# EAGLE schematic Thor_v1 (EAGLE 7.7.0)
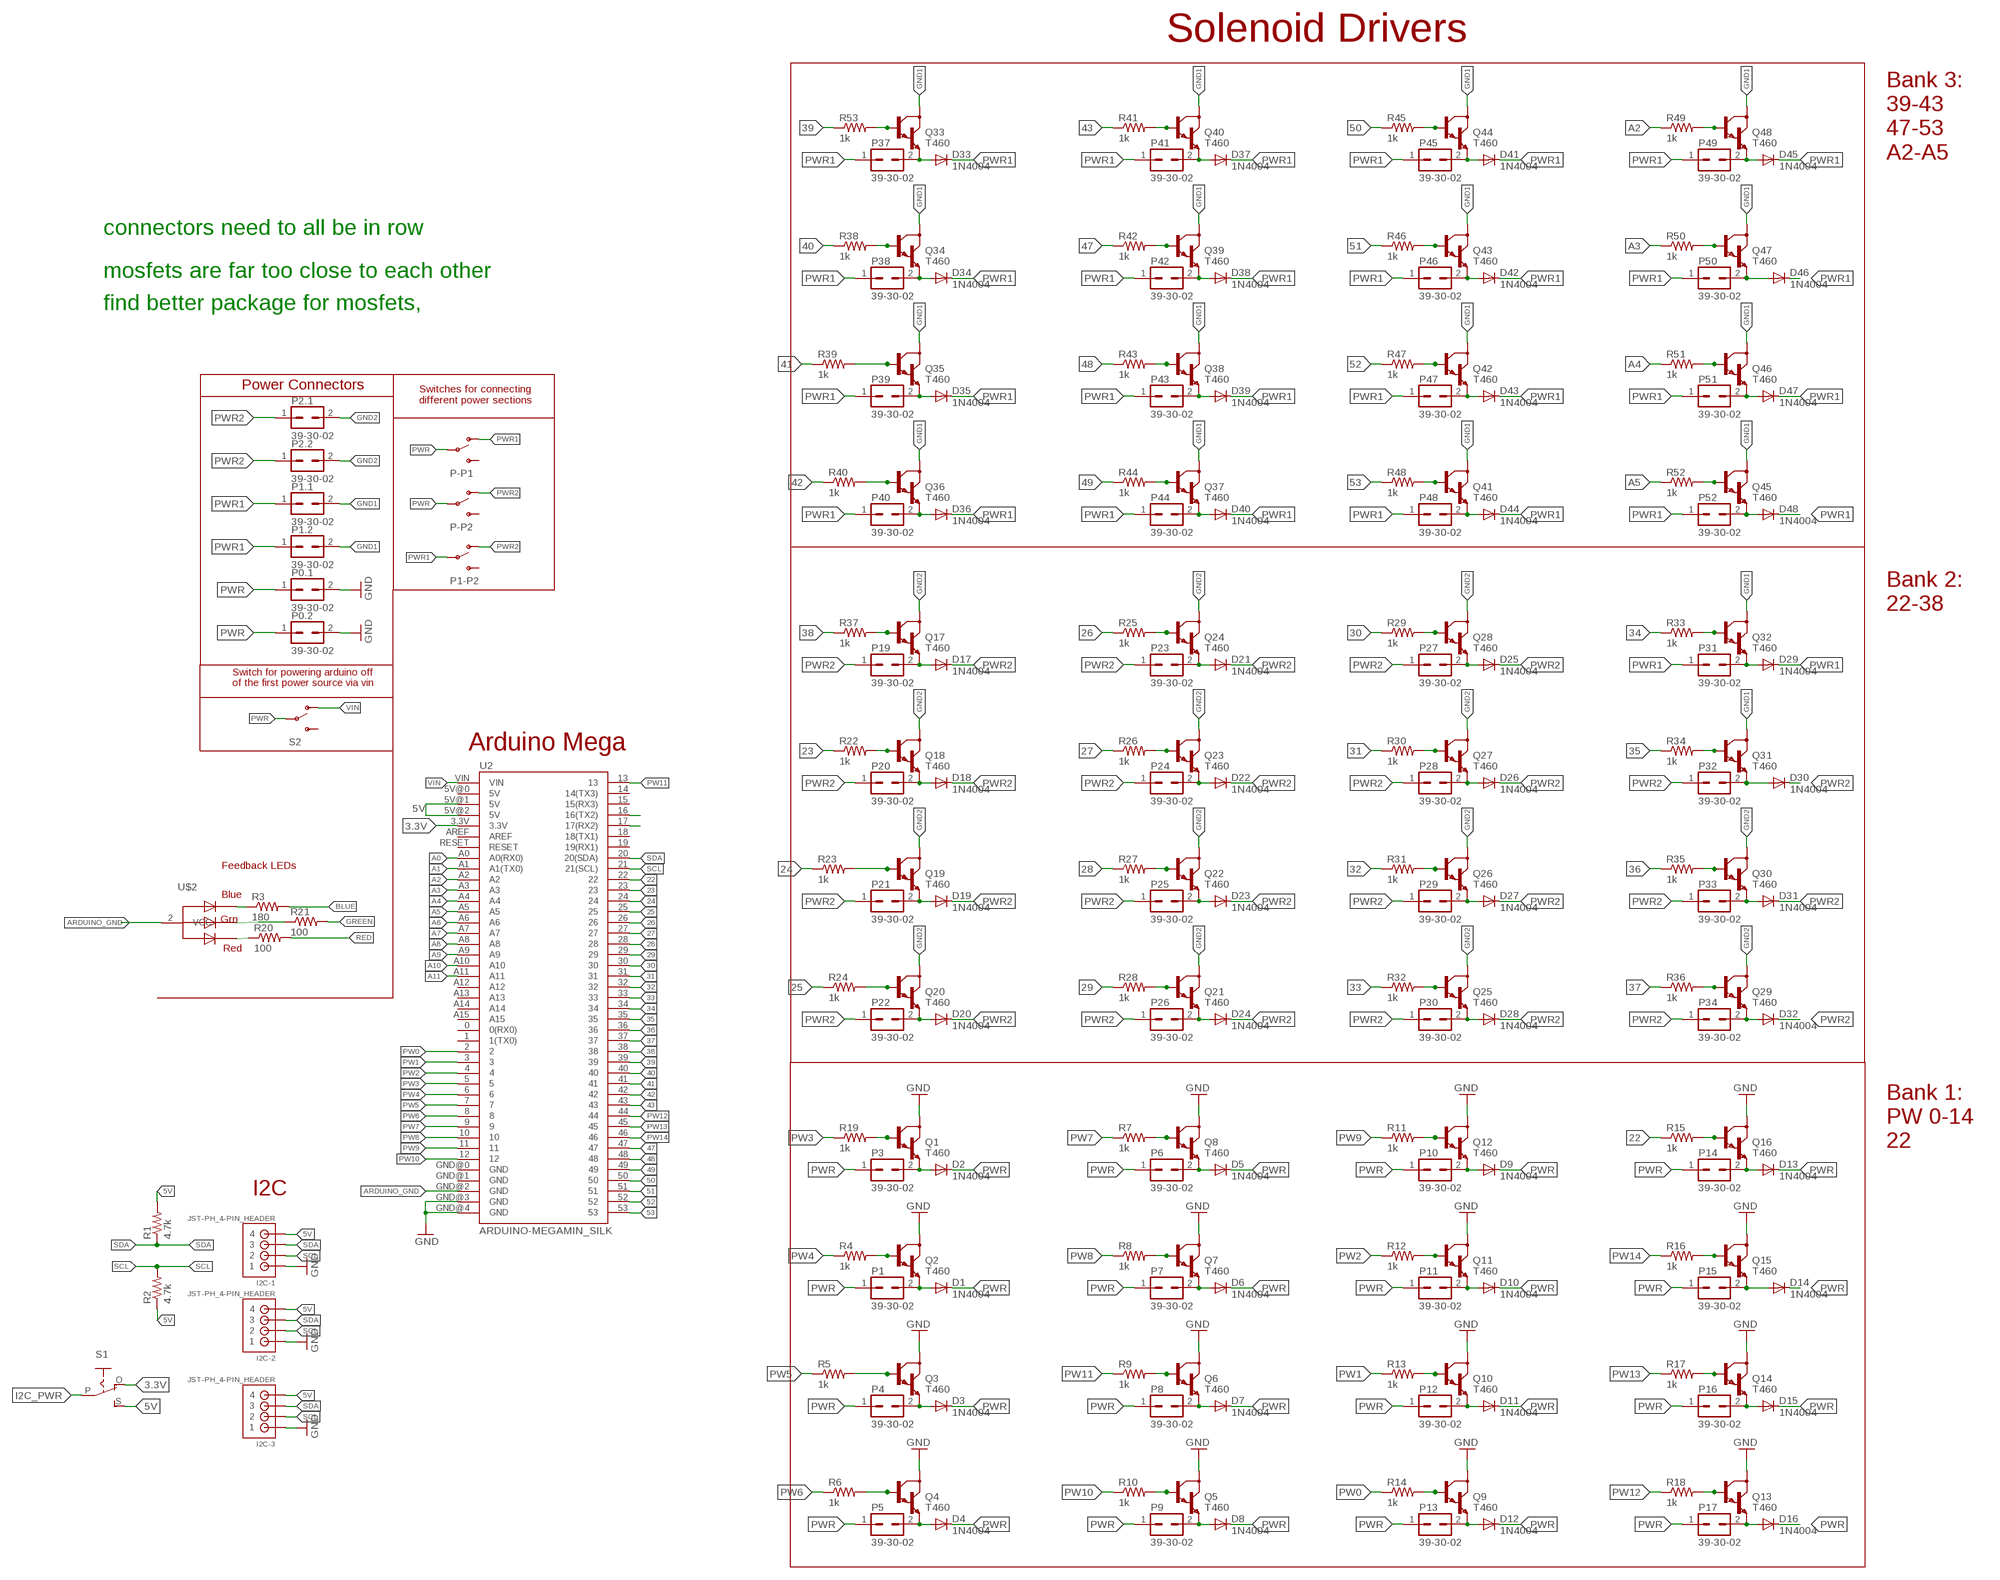
[diagram p0: schematic, sheet 1]

## Parts
D1  1N4004  [DO41-10]
D2  1N4004  [DO41-10]
D3  1N4004  [DO41-10]
D4  1N4004  [DO41-10]
D5  1N4004  [DO41-10]
D6  1N4004  [DO41-10]
D7  1N4004  [DO41-10]
D8  1N4004  [DO41-10]
D9  1N4004  [DO41-10]
D10  1N4004  [DO41-10]
D11  1N4004  [DO41-10]
D12  1N4004  [DO41-10]
D13  1N4004  [DO41-10]
D14  1N4004  [DO41-10]
D15  1N4004  [DO41-10]
D16  1N4004  [DO41-10]
D17  1N4004  [DO41-10]
D18  1N4004  [DO41-10]
D19  1N4004  [DO41-10]
D20  1N4004  [DO41-10]
D21  1N4004  [DO41-10]
D22  1N4004  [DO41-10]
D23  1N4004  [DO41-10]
D24  1N4004  [DO41-10]
D25  1N4004  [DO41-10]
D26  1N4004  [DO41-10]
D27  1N4004  [DO41-10]
D28  1N4004  [DO41-10]
D29  1N4004  [DO41-10]
D30  1N4004  [DO41-10]
D31  1N4004  [DO41-10]
D32  1N4004  [DO41-10]
D33  1N4004  [DO41-10]
D34  1N4004  [DO41-10]
D35  1N4004  [DO41-10]
D36  1N4004  [DO41-10]
D37  1N4004  [DO41-10]
D38  1N4004  [DO41-10]
D39  1N4004  [DO41-10]
D40  1N4004  [DO41-10]
D41  1N4004  [DO41-10]
D42  1N4004  [DO41-10]
D43  1N4004  [DO41-10]
D44  1N4004  [DO41-10]
D45  1N4004  [DO41-10]
D46  1N4004  [DO41-10]
D47  1N4004  [DO41-10]
D48  1N4004  [DO41-10]
I2C-1  JST-PH_4-PIN_HEADER  [JST_B4B-PH_HEADER]
I2C-2  JST-PH_4-PIN_HEADER  [JST_B4B-PH_HEADER]
I2C-3  JST-PH_4-PIN_HEADER  [JST_B4B-PH_HEADER]
P0.1  39-30-02  [39-30-?02?]
P0.2  39-30-02  [39-30-?02?]
P1  39-30-02  [39-30-?02?]
P1-P2  SWITCH-SPDTPTH  [SWITCH-SPDT]
P1.1  39-30-02  [39-30-?02?]
P1.2  39-30-02  [39-30-?02?]
P2.1  39-30-02  [39-30-?02?]
P2.2  39-30-02  [39-30-?02?]
P3  39-30-02  [39-30-?02?]
P4  39-30-02  [39-30-?02?]
P5  39-30-02  [39-30-?02?]
P6  39-30-02  [39-30-?02?]
P7  39-30-02  [39-30-?02?]
P8  39-30-02  [39-30-?02?]
P9  39-30-02  [39-30-?02?]
P10  39-30-02  [39-30-?02?]
P11  39-30-02  [39-30-?02?]
P12  39-30-02  [39-30-?02?]
P13  39-30-02  [39-30-?02?]
P14  39-30-02  [39-30-?02?]
P15  39-30-02  [39-30-?02?]
P16  39-30-02  [39-30-?02?]
P17  39-30-02  [39-30-?02?]
P19  39-30-02  [39-30-?02?]
P20  39-30-02  [39-30-?02?]
P21  39-30-02  [39-30-?02?]
P22  39-30-02  [39-30-?02?]
P23  39-30-02  [39-30-?02?]
P24  39-30-02  [39-30-?02?]
P25  39-30-02  [39-30-?02?]
P26  39-30-02  [39-30-?02?]
P27  39-30-02  [39-30-?02?]
P28  39-30-02  [39-30-?02?]
P29  39-30-02  [39-30-?02?]
P30  39-30-02  [39-30-?02?]
P31  39-30-02  [39-30-?02?]
P32  39-30-02  [39-30-?02?]
P33  39-30-02  [39-30-?02?]
P34  39-30-02  [39-30-?02?]
P37  39-30-02  [39-30-?02?]
P38  39-30-02  [39-30-?02?]
P39  39-30-02  [39-30-?02?]
P40  39-30-02  [39-30-?02?]
P41  39-30-02  [39-30-?02?]
P42  39-30-02  [39-30-?02?]
P43  39-30-02  [39-30-?02?]
P44  39-30-02  [39-30-?02?]
P45  39-30-02  [39-30-?02?]
P46  39-30-02  [39-30-?02?]
P47  39-30-02  [39-30-?02?]
P48  39-30-02  [39-30-?02?]
P49  39-30-02  [39-30-?02?]
P50  39-30-02  [39-30-?02?]
P51  39-30-02  [39-30-?02?]
P52  39-30-02  [39-30-?02?]
P-P1  SWITCH-SPDTPTH  [SWITCH-SPDT]
P-P2  SWITCH-SPDTPTH  [SWITCH-SPDT]
Q1  T460  MJE800  [TO225AAV]
Q2  T460  MJE800  [TO225AAV]
Q3  T460  MJE800  [TO225AAV]
Q4  T460  MJE800  [TO225AAV]
Q5  T460  MJE800  [TO225AAV]
Q6  T460  MJE800  [TO225AAV]
Q7  T460  MJE800  [TO225AAV]
Q8  T460  MJE800  [TO225AAV]
Q9  T460  MJE800  [TO225AAV]
Q10  T460  MJE800  [TO225AAV]
Q11  T460  MJE800  [TO225AAV]
Q12  T460  MJE800  [TO225AAV]
Q13  T460  MJE800  [TO225AAV]
Q14  T460  MJE800  [TO225AAV]
Q15  T460  MJE800  [TO225AAV]
Q16  T460  MJE800  [TO225AAV]
Q17  T460  MJE800  [TO225AAV]
Q18  T460  MJE800  [TO225AAV]
Q19  T460  MJE800  [TO225AAV]
Q20  T460  MJE800  [TO225AAV]
Q21  T460  MJE800  [TO225AAV]
Q22  T460  MJE800  [TO225AAV]
Q23  T460  MJE800  [TO225AAV]
Q24  T460  MJE800  [TO225AAV]
Q25  T460  MJE800  [TO225AAV]
Q26  T460  MJE800  [TO225AAV]
Q27  T460  MJE800  [TO225AAV]
Q28  T460  MJE800  [TO225AAV]
Q29  T460  MJE800  [TO225AAV]
Q30  T460  MJE800  [TO225AAV]
Q31  T460  MJE800  [TO225AAV]
Q32  T460  MJE800  [TO225AAV]
Q33  T460  MJE800  [TO225AAV]
Q34  T460  MJE800  [TO225AAV]
Q35  T460  MJE800  [TO225AAV]
Q36  T460  MJE800  [TO225AAV]
Q37  T460  MJE800  [TO225AAV]
Q38  T460  MJE800  [TO225AAV]
Q39  T460  MJE800  [TO225AAV]
Q40  T460  MJE800  [TO225AAV]
Q41  T460  MJE800  [TO225AAV]
Q42  T460  MJE800  [TO225AAV]
Q43  T460  MJE800  [TO225AAV]
Q44  T460  MJE800  [TO225AAV]
Q45  T460  MJE800  [TO225AAV]
Q46  T460  MJE800  [TO225AAV]
Q47  T460  MJE800  [TO225AAV]
Q48  T460  MJE800  [TO225AAV]
R1  4.7k  RESISTORKIT  [AXIAL-0.3-KIT]
R2  4.7k  RESISTORKIT  [AXIAL-0.3-KIT]
R3  180  RESISTORKIT  [AXIAL-0.3-KIT]
R4  1k  RESISTORKIT  [AXIAL-0.3-KIT]
R5  1k  RESISTORKIT  [AXIAL-0.3-KIT]
R6  1k  RESISTORKIT  [AXIAL-0.3-KIT]
R7  1k  RESISTORKIT  [AXIAL-0.3-KIT]
R8  1k  RESISTORKIT  [AXIAL-0.3-KIT]
R9  1k  RESISTORKIT  [AXIAL-0.3-KIT]
R10  1k  RESISTORKIT  [AXIAL-0.3-KIT]
R11  1k  RESISTORKIT  [AXIAL-0.3-KIT]
R12  1k  RESISTORKIT  [AXIAL-0.3-KIT]
R13  1k  RESISTORKIT  [AXIAL-0.3-KIT]
R14  1k  RESISTORKIT  [AXIAL-0.3-KIT]
R15  1k  RESISTORKIT  [AXIAL-0.3-KIT]
R16  1k  RESISTORKIT  [AXIAL-0.3-KIT]
R17  1k  RESISTORKIT  [AXIAL-0.3-KIT]
R18  1k  RESISTORKIT  [AXIAL-0.3-KIT]
R19  1k  RESISTORKIT  [AXIAL-0.3-KIT]
R20  100  RESISTORKIT  [AXIAL-0.3-KIT]
R21  100  RESISTORKIT  [AXIAL-0.3-KIT]
R22  1k  RESISTORKIT  [AXIAL-0.3-KIT]
R23  1k  RESISTORKIT  [AXIAL-0.3-KIT]
R24  1k  RESISTORKIT  [AXIAL-0.3-KIT]
R25  1k  RESISTORKIT  [AXIAL-0.3-KIT]
R26  1k  RESISTORKIT  [AXIAL-0.3-KIT]
R27  1k  RESISTORKIT  [AXIAL-0.3-KIT]
R28  1k  RESISTORKIT  [AXIAL-0.3-KIT]
R29  1k  RESISTORKIT  [AXIAL-0.3-KIT]
R30  1k  RESISTORKIT  [AXIAL-0.3-KIT]
R31  1k  RESISTORKIT  [AXIAL-0.3-KIT]
R32  1k  RESISTORKIT  [AXIAL-0.3-KIT]
R33  1k  RESISTORKIT  [AXIAL-0.3-KIT]
R34  1k  RESISTORKIT  [AXIAL-0.3-KIT]
R35  1k  RESISTORKIT  [AXIAL-0.3-KIT]
R36  1k  RESISTORKIT  [AXIAL-0.3-KIT]
R37  1k  RESISTORKIT  [AXIAL-0.3-KIT]
R38  1k  RESISTORKIT  [AXIAL-0.3-KIT]
R39  1k  RESISTORKIT  [AXIAL-0.3-KIT]
R40  1k  RESISTORKIT  [AXIAL-0.3-KIT]
R41  1k  RESISTORKIT  [AXIAL-0.3-KIT]
R42  1k  RESISTORKIT  [AXIAL-0.3-KIT]
R43  1k  RESISTORKIT  [AXIAL-0.3-KIT]
R44  1k  RESISTORKIT  [AXIAL-0.3-KIT]
R45  1k  RESISTORKIT  [AXIAL-0.3-KIT]
R46  1k  RESISTORKIT  [AXIAL-0.3-KIT]
R47  1k  RESISTORKIT  [AXIAL-0.3-KIT]
R48  1k  RESISTORKIT  [AXIAL-0.3-KIT]
R49  1k  RESISTORKIT  [AXIAL-0.3-KIT]
R50  1k  RESISTORKIT  [AXIAL-0.3-KIT]
R51  1k  RESISTORKIT  [AXIAL-0.3-KIT]
R52  1k  RESISTORKIT  [AXIAL-0.3-KIT]
R53  1k  RESISTORKIT  [AXIAL-0.3-KIT]
S1  EG1218S  [EG1218]
S2  SWITCH-SPDTPTH  [SWITCH-SPDT]
U2  ARDUINO-MEGAMIN_SILK  [ARDUINO_MEGA_MIN_SILK_NO_OUTLINE]
U$2  RGBLED_CA  [LED5MMRGB]

## Nets
3.3V: S1.O U2.3.3V
5V: I2C-1.P4 I2C-2.P4 I2C-3.P4 R1.P$2 R2.P$1 S1.S U2.5V@1(5V) U2.5V@2(5V)
22: R15.P$1 U2.22
23: R22.P$1 U2.23
24: R23.P$1 U2.24
25: R24.P$1
26: R25.P$1 U2.26
27: R26.P$1 U2.27
28: R27.P$1 U2.28
29: R28.P$1 U2.29
30: R29.P$1 U2.30
31: R30.P$1 U2.31
32: R31.P$1 U2.32
33: R32.P$1 U2.33
34: R33.P$1 U2.34
35: R34.P$1 U2.35
36: R35.P$1 U2.36
37: R36.P$1 U2.37
38: R37.P$1 U2.38
39: R53.P$1 U2.39
40: R38.P$1 U2.40
41: R39.P$1 U2.41
42: R40.P$1 U2.42
43: R41.P$1 U2.43
47: R42.P$1 U2.47
48: R43.P$1 U2.48
49: R44.P$1 U2.49
50: R45.P$1 U2.50
51: R46.P$1 U2.51
52: R47.P$1 U2.52
53: R48.P$1 U2.53
A0: R3.P$1 U2.A0(A0(RX0)) U$2.4(BLUE)
A1: U2.A1(A1(TX0))
A2: R20.P$1 R49.P$1 U2.A2 U$2.1(RED)
A3: R50.P$1 U2.A3
A4: R51.P$1 U2.A4
A5: R52.P$1 U2.A5
A6: U2.A6
A7: U2.A7
A8: U2.A8
A9: U2.A9
A10: U2.A10
A11: U2.A11
ARDUINO_GND: U2.GND@2(GND) U$2.2(VCC)
BLUE: R3.P$2
GND: I2C-1.P1 I2C-2.P1 I2C-3.P1 P0.1.2 P0.2.2 Q1.2(C) Q2.2(C) Q3.2(C) Q4.2(C) Q5.2(C) Q6.2(C) Q7.2(C) Q8.2(C) Q9.2(C) Q10.2(C) Q11.2(C) Q12.2(C) Q13.2(C) Q14.2(C) Q15.2(C) Q16.2(C) U2.GND@3(GND) U2.GND@4(GND)
GND1: P1.1.2 P1.2.2 Q31.2(C) Q32.2(C) Q33.2(C) Q34.2(C) Q35.2(C) Q36.2(C) Q37.2(C) Q38.2(C) Q39.2(C) Q40.2(C) Q41.2(C) Q42.2(C) Q43.2(C) Q44.2(C) Q45.2(C) Q46.2(C) Q47.2(C) Q48.2(C)
GND2: P2.1.2 P2.2.2 Q17.2(C) Q18.2(C) Q19.2(C) Q20.2(C) Q21.2(C) Q22.2(C) Q23.2(C) Q24.2(C) Q25.2(C) Q26.2(C) Q27.2(C) Q28.2(C) Q29.2(C) Q30.2(C)
GREEN: R21.P$2
I2C_PWR: S1.P
N$1: R21.P$1 U$2.3(GREEN)
N$2: D2.A P3.2 Q1.1(E)
N$3: D17.A P19.2 Q17.1(E)
N$4: D1.A P1.2 Q2.1(E)
N$5: D18.A P20.2 Q18.1(E)
N$6: Q1.3(B) R19.P$2
N$7: Q18.3(B) R22.P$2
N$8: U2.16(16(TX2))
N$9: U2.17(17(RX2)) U2.25
N$10: Q2.3(B) R4.P$2
N$11: D3.A P4.2 Q3.1(E)
N$12: D19.A P21.2 Q19.1(E)
N$13: Q19.3(B) R23.P$2
N$14: Q3.3(B) R5.P$2
N$15: D4.A P5.2 Q4.1(E)
N$16: D20.A P22.2 Q20.1(E)
N$18: Q4.3(B) R6.P$2
N$19: D5.A P6.2 Q8.1(E)
N$20: Q20.3(B) R24.P$2
N$21: D21.A P23.2 Q24.1(E)
N$22: Q8.3(B) R7.P$2
N$23: D6.A P7.2 Q7.1(E)
N$24: Q24.3(B) R25.P$2
N$25: D22.A P24.2 Q23.1(E)
N$26: Q7.3(B) R8.P$2
N$27: D7.A P8.2 Q6.1(E)
N$30: Q6.3(B) R9.P$2
N$31: D8.A P9.2 Q5.1(E)
N$33: Q23.3(B) R26.P$2
N$34: Q5.3(B) R10.P$2
N$35: D9.A P10.2 Q12.1(E)
N$36: D23.A P25.2 Q22.1(E)
N$37: Q22.3(B) R27.P$2
N$38: Q12.3(B) R11.P$2
N$39: D10.A P11.2 Q11.1(E)
N$40: D24.A P26.2 Q21.1(E)
N$41: Q21.3(B) R28.P$2
N$42: Q11.3(B) R12.P$2
N$43: D11.A P12.2 Q10.1(E)
N$44: D25.A P27.2 Q28.1(E)
N$45: Q28.3(B) R29.P$2
N$46: Q10.3(B) R13.P$2
N$47: D12.A P13.2 Q9.1(E)
N$48: D26.A P28.2 Q27.1(E)
N$49: Q27.3(B) R30.P$2
N$50: Q9.3(B) R14.P$2
N$51: D13.A P14.2 Q16.1(E)
N$52: D27.A P29.2 Q26.1(E)
N$53: Q26.3(B) R31.P$2
N$54: Q16.3(B) R15.P$2
N$55: D14.A P15.2 Q15.1(E)
N$56: D28.A P30.2 Q25.1(E)
N$57: Q25.3(B) R32.P$2
N$58: Q15.3(B) R16.P$2
N$59: D15.A P16.2 Q14.1(E)
N$60: D29.A P31.2 Q32.1(E)
N$61: Q32.3(B) R33.P$2
N$62: Q14.3(B) R17.P$2
N$63: D16.A P17.2 Q13.1(E)
N$64: D30.A P32.2 Q31.1(E)
N$65: Q31.3(B) R34.P$2
N$66: Q13.3(B) R18.P$2
N$67: D31.A P33.2 Q30.1(E)
N$68: Q30.3(B) R35.P$2
N$69: D32.A P34.2 Q29.1(E)
N$70: Q29.3(B) R36.P$2
N$71: Q17.3(B) R37.P$2
N$72: D33.A P37.2 Q33.1(E)
N$73: D34.A P38.2 Q34.1(E)
N$74: Q34.3(B) R38.P$2
N$75: D35.A P39.2 Q35.1(E)
N$76: Q35.3(B) R39.P$2
N$77: D36.A P40.2 Q36.1(E)
N$78: Q36.3(B) R40.P$2
N$79: D37.A P41.2 Q40.1(E)
N$80: Q40.3(B) R41.P$2
N$81: D38.A P42.2 Q39.1(E)
N$82: Q39.3(B) R42.P$2
N$83: D39.A P43.2 Q38.1(E)
N$84: Q38.3(B) R43.P$2
N$85: D40.A P44.2 Q37.1(E)
N$86: Q37.3(B) R44.P$2
N$87: D41.A P45.2 Q44.1(E)
N$88: Q44.3(B) R45.P$2
N$89: D42.A P46.2 Q43.1(E)
N$90: Q43.3(B) R46.P$2
N$91: D43.A P47.2 Q42.1(E)
N$92: Q42.3(B) R47.P$2
N$93: D44.A P48.2 Q41.1(E)
N$94: Q41.3(B) R48.P$2
N$95: D45.A P49.2 Q48.1(E)
N$96: Q48.3(B) R49.P$2
N$97: D46.A P50.2 Q47.1(E)
N$98: Q47.3(B) R50.P$2
N$99: D47.A P51.2 Q46.1(E)
N$100: Q46.3(B) R51.P$2
N$101: D48.A P52.2 Q45.1(E)
N$102: Q45.3(B) R52.P$2
N$103: Q33.3(B) R53.P$2
PW0: R14.P$1 U2.2
PW1: R13.P$1 U2.3
PW2: R12.P$1 U2.4
PW3: R19.P$1 U2.5
PW4: R4.P$1 U2.6
PW5: R5.P$1 U2.7
PW6: R6.P$1 U2.8
PW7: R7.P$1 U2.9
PW8: R8.P$1 U2.10
PW9: R11.P$1 U2.11
PW10: R10.P$1 U2.12
PW11: R9.P$1 U2.13
PW12: R18.P$1 U2.44
PW13: R17.P$1 U2.45
PW14: R16.P$1 U2.46
PWR: D1.C D2.C D3.C D4.C D5.C D6.C D7.C D8.C D9.C D10.C D11.C D12.C D13.C D14.C D15.C D16.C P0.1.1 P0.2.1 P1.1 P3.1 P4.1 P5.1 P6.1 P7.1 P8.1 P9.1 P10.1 P11.1 P12.1 P13.1 P14.1 P15.1 P16.1 P17.1 P-P1.2(P) P-P2.2(P) S2.2(P)
PWR1: D29.C D33.C D34.C D35.C D36.C D37.C D38.C D39.C D40.C D41.C D42.C D43.C D44.C D45.C D46.C D47.C D48.C P1-P2.2(P) P1.1.1 P1.2.1 P31.1 P37.1 P38.1 P39.1 P40.1 P41.1 P42.1 P43.1 P44.1 P45.1 P46.1 P47.1 P48.1 P49.1 P50.1 P51.1 P52.1 P-P1.1(O)
PWR2: D17.C D18.C D19.C D20.C D21.C D22.C D23.C D24.C D25.C D26.C D27.C D28.C D30.C D31.C D32.C P1-P2.1(O) P2.1.1 P2.2.1 P19.1 P20.1 P21.1 P22.1 P23.1 P24.1 P25.1 P26.1 P27.1 P28.1 P29.1 P30.1 P32.1 P33.1 P34.1 P-P2.1(O)
RED: R20.P$2
SCL: I2C-1.P2 I2C-2.P2 I2C-3.P2 R2.P$2 U2.21(21(SCL))
SDA: I2C-1.P3 I2C-2.P3 I2C-3.P3 R1.P$1 U2.20(20(SDA))
VIN: S2.1(O) U2.VIN
Unconnected: P1-P2.3(S) P-P1.3(S) P-P2.3(S) S2.3(S) U2.0(0(RX0)) U2.1(1(TX0)) U2.5V@0(5V) U2.14(14(TX3)) U2.15(15(RX3)) U2.18(18(TX1)) U2.19(19(RX1)) U2.A12 U2.A13 U2.A14 U2.A15 U2.AREF U2.GND@0(GND) U2.GND@1(GND) U2.RESET

## Notes on the sheet
- Solenoid Drivers
- Bank 3: 
  39-43
  47-53
  A2-A5
- connectors need to all be in row
- mosfets are far too close to each other
- find better package for mosfets,
- Power Connectors
- Switches for connecting
  different power sections
- Bank 2:
  22-38
- Switch for powering arduino off 
  of the first power source via vin
- Arduino Mega
- Feedback LEDs
- Bank 1:
  PW 0-14
  22
- I2C

## Library data of the parts
D1-D48 = adafruit:1N4004: DIODE General purpose 1N400x type rectifier (With bigger pads) http://www.ladyada.net/library/pcb/eaglelibrary.html
I2C-1-I2C-3 = JST_connectors:JST-PH_4-PIN_HEADER: 4-pin JST PH Shrouded Header, top entry P/N B4B-PH-K-S Mating connector PHR-4 Mating cable assembly: Sparkfun PRT-09916 <http://www.sparkfun.com/products/9916>
P0.1 P0.2 P1 P1.1 P1.2 P2.1 P2.2 P3-P17 P19-P34 P37-P52 = con-molex-mini-fit:39-30-?02?: HEADER
P1-P2 P-P1 P-P2 S2 = SparkFun-Electromechanical:SWITCH-SPDT: SPDT Switch Simple slide switch, Spark Fun Electronics SKU : COM-00102 DPDT SMT slide switch, AYZ0202, SWCH-08179; PROD_ID: SWCH-08261
Q1-Q48 = transistor-npn:MJE800*: NPN Darlington Transistor
R1-R53 = SparkFun-Passives:RESISTOR: Resistor Basic schematic elements and footprints for 0603, 1206, and PTH resistors.
S1 = adafruit:EG1218: SLIDING SWITCH 0.1" spacing through hole, vertical SPDT slide switch http://www.ladyada.net/library/pcb/eaglelibrary.html
U2 = SparkFun-Boards:ARDUINO-MEGA: Arduino Mega board footprint
U$2 = adafruit:RGBLED_CA: RGB LED, common-anode Staggered pins http://www.ladyada.net/library/pcb/eaglelibrary.html

## Net classes
0 default: width 0.762 mm, drill 0.762 mm, clearance 0.508 mm
1 PWR: width 1.016 mm, drill 0.762 mm, clearance 0.508 mm
2 GND: width 1.016 mm, drill 0.762 mm, clearance 0.508 mm